# Altium schematic sheet proximal.SchDoc
size A4
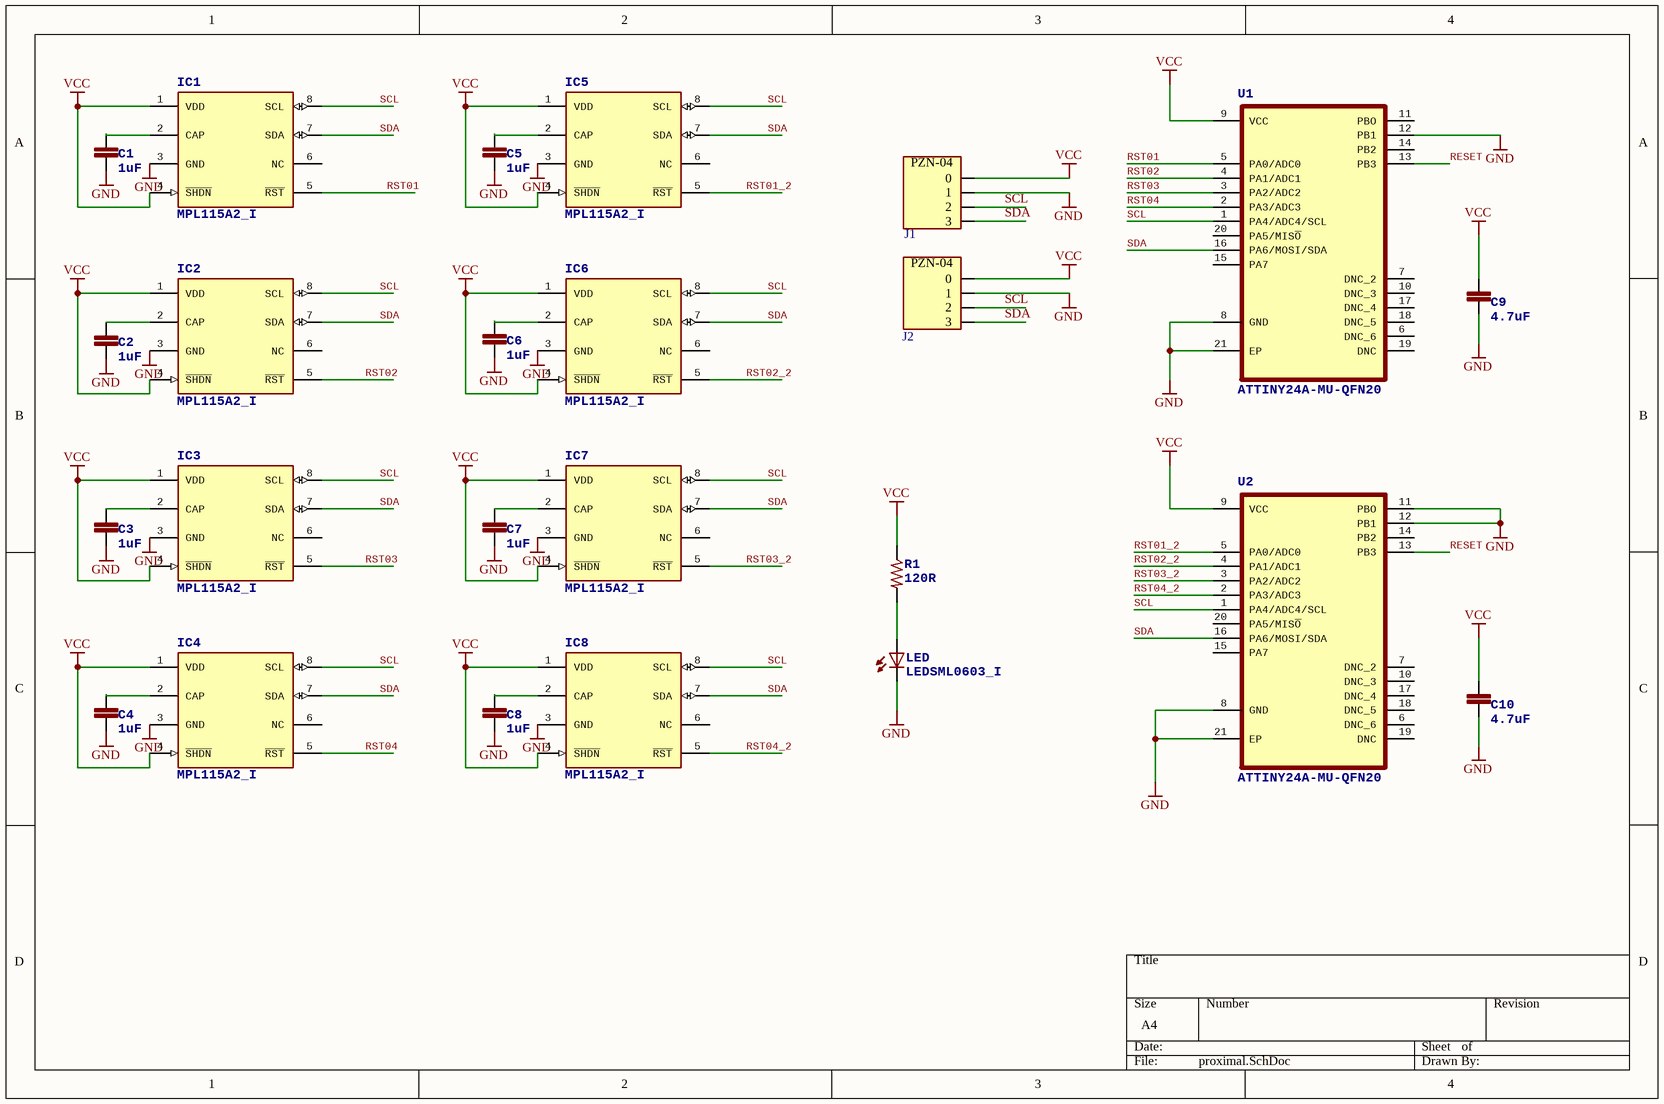
[diagram p0: proximal.SchDoc]

## Parts
C1  1uF  [C0402]
C2  1uF  [C0402]
C3  1uF  [C0402]
C4  1uF  [C0402]
C5  1uF  [C0402]
C6  1uF  [C0402]
C7  1uF  [C0402]
C8  1uF  [C0402]
C9  4.7uF  [C0402]
C10  4.7uF  [C0402]
IC1  MPL115A2_I  [MPL115A2]
IC2  MPL115A2_I  [MPL115A2]
IC3  MPL115A2_I  [MPL115A2]
IC4  MPL115A2_I  [MPL115A2]
IC5  MPL115A2_I  [MPL115A2]
IC6  MPL115A2_I  [MPL115A2]
IC7  MPL115A2_I  [MPL115A2]
IC8  MPL115A2_I  [MPL115A2]
J1  PZN-04_I  [PZN-04-VV]  (value not drawn)
J2  PZN-04_I  [PZN-04-VV]  (value not drawn)
LED  LEDSML0603_I  [SML0603]
R1  120R  [R0402]
U1  ATTINY24A-MU-QFN20  [QFN50P400X400X80-21N]
U2  ATTINY24A-MU-QFN20  [QFN50P400X400X80-21N]

## Nets
GND: C1.2 C2.2 C3.2 C4.2 C5.2 C6.2 C7.2 C8.2 C9.2 C10.2 IC1.3(GND) IC2.3(GND) IC3.3(GND) IC4.3(GND) IC5.3(GND) IC6.3(GND) IC7.3(GND) IC8.3(GND) J1.1 J2.1 LED.C U1.8(GND) U1.12(PB1) U1.21(EP) U2.8(GND) U2.11(PBO) U2.12(PB1) U2.21(EP)
VCC: C9.1 C10.1 IC1.1(VDD) IC1.4(~{SHDN}) IC2.1(VDD) IC2.4(~{SHDN}) IC3.1(VDD) IC3.4(~{SHDN}) IC4.1(VDD) IC4.4(~{SHDN}) IC5.1(VDD) IC5.4(~{SHDN}) IC6.1(VDD) IC6.4(~{SHDN}) IC7.1(VDD) IC7.4(~{SHDN}) IC8.1(VDD) IC8.4(~{SHDN}) J1.0 J2.0 R1.2 U1.9(VCC) U2.9(VCC)
RESET: U1.13(PB3) U2.13(PB3)
RST01: IC1.5(~{RST}) U1.5(PA0/ADC0)
RST01_2: IC5.5(~{RST}) U2.5(PA0/ADC0)
RST02: IC2.5(~{RST}) U1.4(PA1/ADC1)
RST02_2: IC6.5(~{RST}) U2.4(PA1/ADC1)
RST03: IC3.5(~{RST}) U1.3(PA2/ADC2)
RST03_2: IC7.5(~{RST}) U2.3(PA2/ADC2)
RST04: IC4.5(~{RST}) U1.2(PA3/ADC3)
RST04_2: IC8.5(~{RST}) U2.2(PA3/ADC3)
SCL: IC1.8(SCL) IC2.8(SCL) IC3.8(SCL) IC4.8(SCL) IC5.8(SCL) IC6.8(SCL) IC7.8(SCL) IC8.8(SCL) J1.2 J2.2 U1.1(PA4/ADC4/SCL) U2.1(PA4/ADC4/SCL)
SDA: IC1.7(SDA) IC2.7(SDA) IC3.7(SDA) IC4.7(SDA) IC5.7(SDA) IC6.7(SDA) IC7.7(SDA) IC8.7(SDA) J1.3 J2.3 U1.16(PA6/MOSI/SDA) U2.16(PA6/MOSI/SDA)
NetC1_1: C1.1 IC1.2(CAP)
NetC2_1: C2.1 IC2.2(CAP)
NetC3_1: C3.1 IC3.2(CAP)
NetC4_1: C4.1 IC4.2(CAP)
NetC5_1: C5.1 IC5.2(CAP)
NetC6_1: C6.1 IC6.2(CAP)
NetC7_1: C7.1 IC7.2(CAP)
NetC8_1: C8.1 IC8.2(CAP)
NetLED_A: LED.A R1.1

Not connected (* = marked no-connect by the designer): IC1 6(NC); IC2 6(NC); IC3 6(NC); IC4 6(NC); IC5 6(NC); IC6 6(NC); IC7 6(NC); IC8 6(NC); U1 6(DNC_6) 7(DNC_2) 10(DNC_3) 11(PBO) 14(PB2) 15(PA7) 17(DNC_4) 18(DNC_5) 19(DNC) 20(PA5/MIS~{O}); U2 6(DNC_6) 7(DNC_2) 10(DNC_3) 14(PB2) 15(PA7) 17(DNC_4) 18(DNC_5) 19(DNC) 20(PA5/MIS~{O})

## Notes on the sheet
- (in symbol PZN-04_I) PZN-04

## Library data of the parts
C1-C8 = C0402_I: Capacitor - Imperial Units
C9 C10 = C-EUC0402: CAPACITOR, European symbol
IC1-IC8 = MPL115A2_I: Barometer - Imperial Units
J1 J2 = PZN-04_I: Omnetics PTN Connector 4 pins, Horizontal, Design 1 - Imperial Units
LED = LEDSML0603_I: LED   OSRAM: - CHIPLED LG R971, LG N971, LY N971, LG Q971, LY Q971, LO R971, LY R971 LH N974, LH R974 LS Q976, LO Q976, LY Q976 LO Q996 - Hyper CHIPLED LW Q18S LB Q993, LB Q99A, LB R99A - SideLED LS A670, LO A670, LY A670, LG A670, LP A670 LB A673, LV A673, LT A673, LW A673 LH A674 LY A675 LS A676, LA A676, LO A676, LY A676, LW A676 LS A679, LY A679, LG A679 -  Hyper Micro SIDELED® LS Y876, LA Y876, LO Y876, LY Y876 LT Y87S - SmartLED LW L88C, LW L88S LB L89C, LB L89S, LG L890 LS L89K, LO L89K, LY L89K LS L896, LA L896, LO L896, LY L896 - TOPLED LS T670, LO T670, LY T670, LG T670, LP T670 LSG T670, LSP T670, LSY T670, LOP T670, LYG T670 LG T671, LOG T671, LSG T671 LB T673, LV T673, LT T673, LW T673 LH T674 LS T676, LA T676, LO T676, LY T676, LB T676, LH T676, LSB T676, LW T676 LB T67C, LV T67C, LT T67C, LS T67K, LO T67K, LY T67K, LW E67C LS E67B, LA E67B, LO E67B, LY E67B, LB E67C, LV E67C, LT E67C LW T67C LS T679, LY T679, LG T679 LS T770, LO T770, LY T770, LG T770, LP T770 LB T773, LV T773, LT T773, LW T773 LH T774 LS E675, LA E675, LY E675, LS T675 LS T776, LA T776, LO T776, LY T776, LB T776 LHGB T686 LT T68C, LB T68C - Hyper Mini TOPLED® LB M676 - Mini TOPLED Santana® LG M470 LS M47K, LO M47K, LY M47K    Source: http://www.osram.convergy.de   LUXEON: - LUMILED® LXK2-PW12-R00, LXK2-PW12-S00, LXK2-PW14-U00, LXK2-PW14-V00 LXK2-PM12-R00, LXK2-PM12-S00, LXK2-PM14-U00 LXK2-PE12-Q00, LXK2-PE12-R00, LXK2-PE12-S00, LXK2-PE14-T00, LXK2-PE14-U00 LXK2-PB12-K00, LXK2-PB12-L00, LXK2-PB12-M00, LXK2-PB14-N00, LXK2-PB14-P00, LXK2-PB14-Q00 LXK2-PR12-L00, LXK2-PR12-M00, LXK2-PR14-Q00, LXK2-PR14-R00 LXK2-PD12-Q00, LXK2-PD12-R00, LXK2-PD12-S00 LXK2-PH12-R00, LXK2-PH12-S00 LXK2-PL12-P00, LXK2-PL12-Q00, LXK2-PL12-R00    Source: www.luxeon.com   KINGBRIGHT: KA-3528ASYC
R1 = R0402_I: Resistor - Imperial Units
U1 U2 = ATTINY24A-MU_I: Microcontroller - Imperial Units; MPN: ATTINY24A-MU; OC_FARNELL: 1748542; OC_NEWARK: 26R5649; PACKAGE: QFN-20; SUPPLIER: Atmel